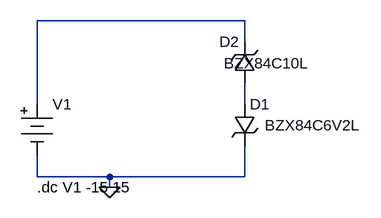
[diagram p0: schematic sch2.asc]
sch2.asc, the LTspice schematic file:
Version 4
SHEET 1 880 680
WIRE 256 112 -64 112
WIRE 256 144 256 112
WIRE -64 240 -64 112
WIRE 256 240 256 208
WIRE -64 352 -64 320
WIRE 48 352 -64 352
WIRE 256 352 256 304
WIRE 256 352 48 352
WIRE 48 368 48 352
FLAG 48 368 0
SYMBOL Misc\\battery -64 224 R0
WINDOW 123 0 0 Left 2
WINDOW 39 0 0 Left 2
SYMATTR InstName V1
SYMATTR Value ""
SYMBOL zener 240 240 R0
WINDOW 3 47 33 Left 2
SYMATTR InstName D1
SYMATTR Value BZX84C6V2L
SYMATTR Description Diode
SYMATTR Type diode
SYMBOL zener 272 208 R180
WINDOW 0 24 64 Left 2
WINDOW 3 -83 31 Left 2
SYMATTR InstName D2
SYMATTR Value BZX84C10L
SYMATTR Description Diode
SYMATTR Type diode
TEXT -64 368 Left 2 !.dc V1 -15 15

The netlist it stands for:
* sch2.asc
V1 N001 0
D1 N002 0 BZX84C6V2L
D2 N002 N001 BZX84C10L
.model D D
.lib standard.dio
.dc V1 -15 15
.backanno
.end